# EAGLE schematic pcb_telemetria (EAGLE 9.4.2)
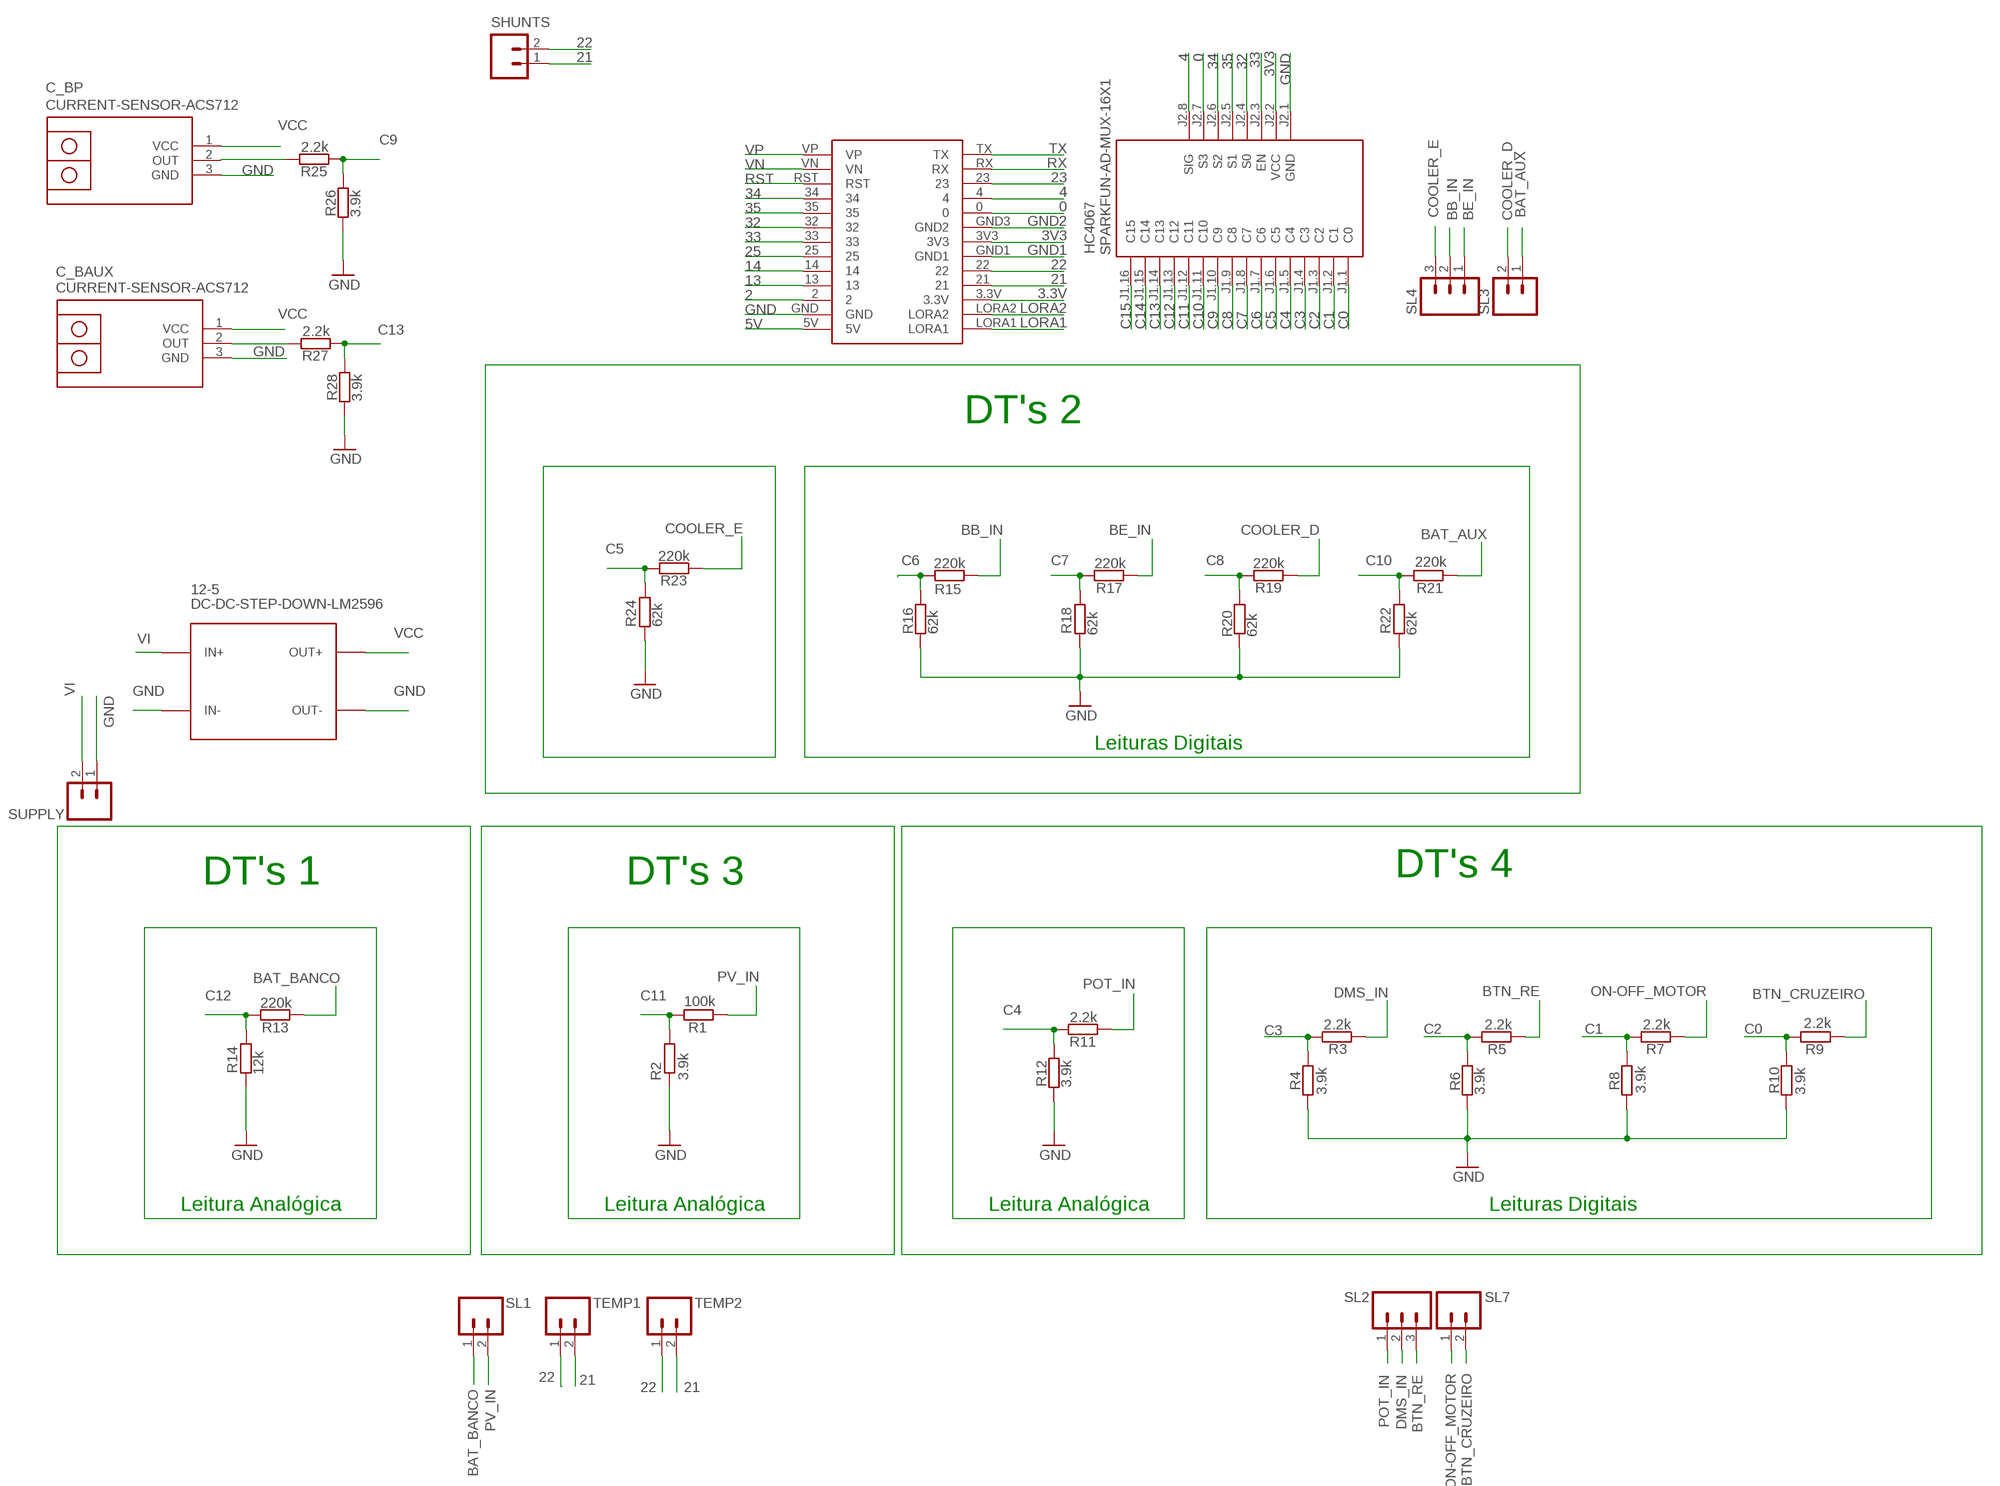
[diagram p0: schematic, sheet 1]

## Parts
12-5  DC-DC-STEP-DOWN-LM2596  [DC-DC-STEP-DOWN-LM2596]
C_BAUX  CURRENT-SENSOR-ACS712  [CURRENT-SENSOR-ACS712]
C_BP  CURRENT-SENSOR-ACS712  [CURRENT-SENSOR-ACS712]
HC4067  SPARKFUN-AD-MUX-16X1  [SPARKFUN-AD-MUX-16X1]
R1  100k  R-EU_0204/7  [0204/7]
R2  3.9k  R-EU_0204/7  [0204/7]
R3  2.2k  R-EU_0204/7  [0204/7]
R4  3.9k  R-EU_0204/7  [0204/7]
R5  2.2k  R-EU_0204/7  [0204/7]
R6  3.9k  R-EU_0204/7  [0204/7]
R7  2.2k  R-EU_0204/7  [0204/7]
R8  3.9k  R-EU_0204/7  [0204/7]
R9  2.2k  R-EU_0204/7  [0204/7]
R10  3.9k  R-EU_0204/7  [0204/7]
R11  2.2k  R-EU_0204/7  [0204/7]
R12  3.9k  R-EU_0204/7  [0204/7]
R13  220k  R-EU_0204/7  [0204/7]
R14  12k  R-EU_0204/7  [0204/7]
R15  220k  R-EU_0204/7  [0204/7]
R16  62k  R-EU_0204/7  [0204/7]
R17  220k  R-EU_0204/7  [0204/7]
R18  62k  R-EU_0204/7  [0204/7]
R19  220k  R-EU_0204/7  [0204/7]
R20  62k  R-EU_0204/7  [0204/7]
R21  220k  R-EU_0204/7  [0204/7]
R22  62k  R-EU_0204/7  [0204/7]
R23  220k  R-EU_0204/7  [0204/7]
R24  62k  R-EU_0204/7  [0204/7]
R25  2.2k  R-EU_0204/7  [0204/7]
R26  3.9k  R-EU_0204/7  [0204/7]
R27  2.2k  R-EU_0204/7  [0204/7]
R28  3.9k  R-EU_0204/7  [0204/7]
SHUNTS  M02  [02P]
SL1  M02  [02P]
SL2  M03  [03P]
SL3  M02  [02P]
SL4  M03  [03P]
SL7  M02  [02P]
SUPPLY  M02  [02P]
TEMP1  M02  [02P]
TEMP2  M02  [02P]
U$1  TTGOBEAM  [TTGOBEAM]

## Nets
0: HC4067.J2.7(S3) U$1.0
2: U$1.2
3.3V: U$1.3.3V
3V3: HC4067.J2.2(VCC) U$1.3V3
4: HC4067.J2.8(SIG) U$1.4
5V: U$1.5V
13: U$1.13
14: U$1.14
21: SHUNTS.1 TEMP1.2 TEMP2.2 U$1.21
22: SHUNTS.2 TEMP1.1 TEMP2.1 U$1.22
23: U$1.23
25: U$1.25
32: HC4067.J2.4(S0) U$1.32
33: HC4067.J2.3(EN) U$1.33
34: HC4067.J2.6(S2) U$1.34
35: HC4067.J2.5(S1) U$1.35
BAT_AUX: R21.2 SL3.1
BAT_BANCO: R13.2 SL1.1
BB_IN: R15.1 SL4.2
BE_IN: R17.2 SL4.1
BTN_CRUZEIRO: R9.2 SL7.2
BTN_RE: R5.2 SL2.3
C0: HC4067.J1.1(C0) R9.1 R10.2
C1: HC4067.J1.2(C1) R7.2 R8.1
C2: HC4067.J1.3(C2) R5.1 R6.2
C3: HC4067.J1.4(C3) R3.2 R4.1
C4: HC4067.J1.5(C4) R11.2 R12.1
C5: HC4067.J1.6(C5) R23.2 R24.1
C6: HC4067.J1.7(C6) R15.2 R16.1
C7: HC4067.J1.8(C7) R17.1 R18.2
C8: HC4067.J1.9(C8) R19.2 R20.1
C9: HC4067.J1.10(C9) R25.1 R26.1
C10: HC4067.J1.11(C10) R21.1 R22.2
C11: HC4067.J1.12(C11) R1.1 R2.2
C12: HC4067.J1.13(C12) R13.1 R14.2
C13: HC4067.J1.14(C13) R27.1 R28.1
C14: HC4067.J1.15(C14)
C15: HC4067.J1.16(C15)
COOLER_D: R19.1 SL3.2
COOLER_E: R23.1 SL4.3
DMS_IN: R3.1 SL2.2
GND: 12-5.IN- 12-5.OUT- C_BAUX.3(GND) C_BP.3(GND) HC4067.J2.1(GND) R2.1 R4.2 R6.1 R8.2 R10.1 R12.2 R14.1 R16.2 R18.1 R20.2 R22.1 R24.2 R26.2 R28.2 SUPPLY.1 U$1.GND
GND1: U$1.GND1
GND2: U$1.GND3(GND2)
LORA1: U$1.LORA1
LORA2: U$1.LORA2
N$1: C_BP.2(OUT) R25.2
N$2: C_BAUX.2(OUT) R27.2
ON-OFF_MOTOR: R7.1 SL7.1
POT_IN: R11.1 SL2.1
PV_IN: R1.2 SL1.2
RST: U$1.RST
RX: U$1.RX
TX: U$1.TX
VCC: 12-5.OUT+ C_BAUX.1(VCC) C_BP.1(VCC)
VI: 12-5.IN+ SUPPLY.2
VN: U$1.VN
VP: U$1.VP

## Notes on the sheet
- DT's 2
- Leituras Digitais
- DT's 1 | DT's 3 | DT's 4
- Leitura Analógica | Leitura Analógica | Leitura Analógica | Leituras Digitais

## Library data of the parts
12-5 = diy-modules:DC-DC-STEP-DOWN-LM2596: DC/DC Step-Down Regulator based on LM2596-ADJ chip LM2596 datasheet available here: http://www.ti.com/lit/ds/symlink/lm2596.pdf Click here to find device on ebay.com <http://www.ebay.com/sch/lm2596+power+regulator>
C_BAUX C_BP = diy-modules:CURRENT-SENSOR-ACS712: Isolated Bipolar Current Sensors based on ACS712 chip More details available here: http://embedded-lab.com/blog/a-brief-overview-of-allegro-acs712-current-sensor-part-1/ Click here to find device on ebay.com <http://www.ebay.com/sch/acs712+module> Note: There are many available versions with different pinout. Please check before use
HC4067 = diy-modules:SPARKFUN-AD-MUX-16X1: SparkFun Analog/Digital MUX Breakout based on CD74HC4067 chip Source: https://www.sparkfun.com/products/9056
R1-R28 = rcl:R-EU_: RESISTOR, European symbol; SPICEPREFIX: R
SHUNTS SL1 SL3 SL7 SUPPLY TEMP1 TEMP2 = con-amp-quick:M02: AMP QUICK CONNECTOR; OC_FARNELL: unknown; OC_NEWARK: unknown
SL2 SL4 = con-amp-quick:M03: AMP QUICK CONNECTOR; OC_FARNELL: unknown; OC_NEWARK: unknown
U$1 = bibliotecattgo:TTGOBEAM